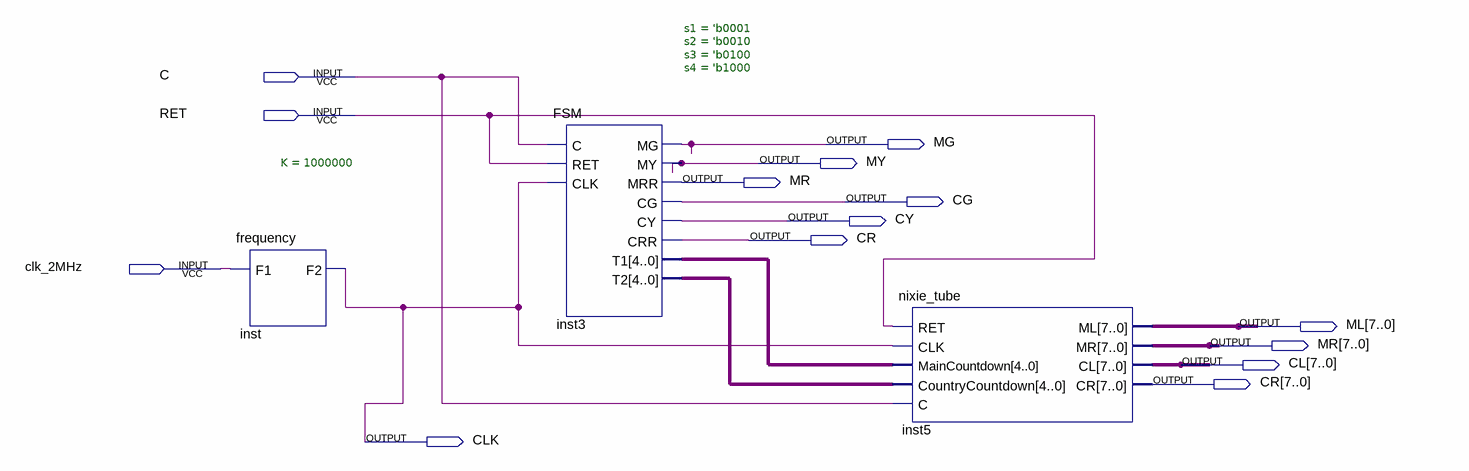
[diagram p0: schematic sheet]
// Quartus schematic traffic_light.bdf as structural Verilog: 3 symbols, 14 pins
module traffic_light (
  input  C,
  input  RET,
  input  clk_2MHz,
  output MG,
  output MY,
  output MR_1bit,
  output CG,
  output CY,
  output CR_1bit,
  output [7:0] ML,
  output [7:0] MR,
  output [7:0] CL,
  output [7:0] CR,
  output CLK
);

  wire [4:0] inst3_t1, inst3_t2;

  frequency #(.K(1000000)) inst (.F1(clk_2MHz), .F2(CLK));
  FSM #(.s1('b0001), .s2('b0010), .s3('b0100), .s4('b1000)) inst3 (
    .C(C), .RET(RET), .CLK(CLK), .MG(MG), .MY(MY), .MRR(MR_1bit), .CG(CG), .CY(CY), .CRR(CR_1bit),
    .T1(inst3_t1), .T2(inst3_t2));
  nixie_tube inst5 (
    .RET(RET), .CLK(CLK), .MainCountdown(inst3_t1), .CountryCountdown(inst3_t2), .C(C), .ML(ML), .MR(MR),
    .CL(CL), .CR(CR));
endmodule
